# EAGLE design DiveComputer_STM32 (EAGLE 7.2.0)
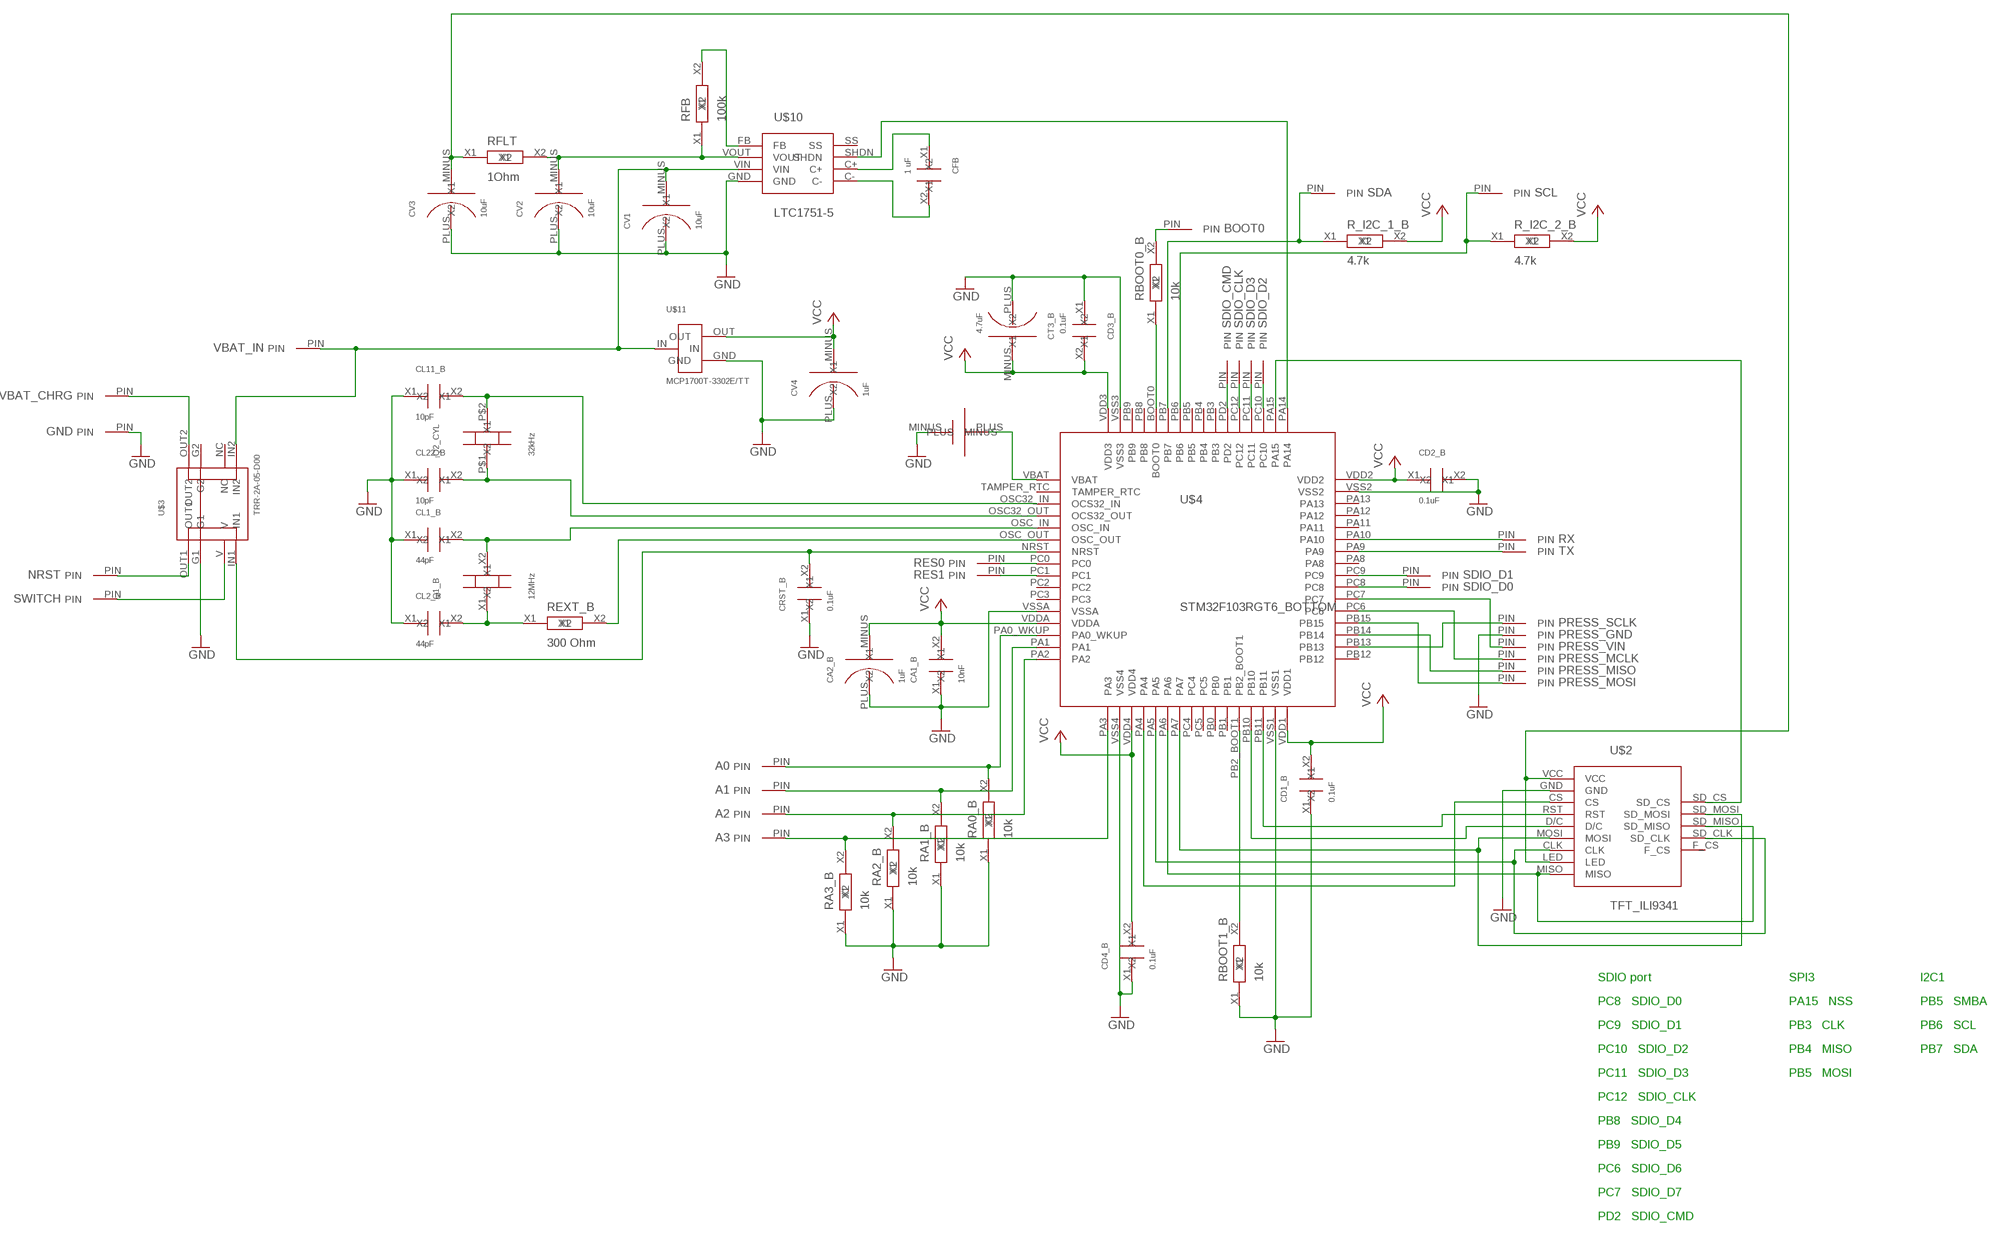
[diagram p0: schematic, sheet 1]

## Parts
A0  PIN  [PIN]
A1  PIN  [PIN]
A2  PIN  [PIN]
A3  PIN  [PIN]
BOOT0  PIN  [PIN]
CA1_B  10nF  C_SMD_2.1X1.25_BOTTOM  [SMD_2.1X1.25_BOTTOM]
CA2_B  1uF  C_SMD_TA_A_BOTTOM  [C_SMD_TA_A_BOTTOM]
CD1_B  0.1uF  C_SMD_2.1X1.25_BOTTOM  [SMD_2.1X1.25_BOTTOM]
CD2_B  0.1uF  C_SMD_2.1X1.25_BOTTOM  [SMD_2.1X1.25_BOTTOM]
CD3_B  0.1uF  C_SMD_2.1X1.25_BOTTOM  [SMD_2.1X1.25_BOTTOM]
CD4_B  0.1uF  C_SMD_2.1X1.25_BOTTOM  [SMD_2.1X1.25_BOTTOM]
CFB  1 uF  C_SMD_2.1X1.25  [SMD_2.1X1.25]
CL1_B  44pF  C_SMD_2.1X1.25_BOTTOM  [SMD_2.1X1.25_BOTTOM]
CL2_B  44pF  C_SMD_2.1X1.25_BOTTOM  [SMD_2.1X1.25_BOTTOM]
CL11_B  10pF  C_SMD_2.1X1.25_BOTTOM  [SMD_2.1X1.25_BOTTOM]
CL22_B  10pF  C_SMD_2.1X1.25_BOTTOM  [SMD_2.1X1.25_BOTTOM]
CRST_B  0.1uF  C_SMD_2.1X1.25_BOTTOM  [SMD_2.1X1.25_BOTTOM]
CT3_B  4.7uF  C_SMD_TA_A_BOTTOM  [C_SMD_TA_A_BOTTOM]
CV1  10uF  C_SMD_TA_A  [C_SMD_TA_A]
CV2  10uF  C_SMD_TA_A  [C_SMD_TA_A]
CV3  10uF  C_SMD_TA_A  [C_SMD_TA_A]
CV4  1uF  C_SMD_TA_A  [C_SMD_TA_A]
GND  PIN  [PIN]
NRST  PIN  [PIN]
PRESS_GND  PIN  [PIN]
PRESS_MCLK  PIN  [PIN]
PRESS_MISO  PIN  [PIN]
PRESS_MOSI  PIN  [PIN]
PRESS_SCLK  PIN  [PIN]
PRESS_VIN  PIN  [PIN]
Q1_B  12MHz  QUARTZ_SMD_BOTTOM  [QUARTZ_SMD_BOTTOM]
Q2_CYL  32kHz  QUARTZ_CYL  [QUARTZ_CYL]
R_I2C_1_B  4.7k  R_SMD_2.1X1.25_BOTTOM  [SMD_2.1X1.25_BOTTOM]
R_I2C_2_B  4.7k  R_SMD_2.1X1.25_BOTTOM  [SMD_2.1X1.25_BOTTOM]
RA0_B  10k  R_SMD_2.1X1.25_BOTTOM  [SMD_2.1X1.25_BOTTOM]
RA1_B  10k  R_SMD_2.1X1.25_BOTTOM  [SMD_2.1X1.25_BOTTOM]
RA2_B  10k  R_SMD_2.1X1.25_BOTTOM  [SMD_2.1X1.25_BOTTOM]
RA3_B  10k  R_SMD_2.1X1.25_BOTTOM  [SMD_2.1X1.25_BOTTOM]
RBOOT0_B  10k  R_SMD_2.1X1.25_BOTTOM  [SMD_2.1X1.25_BOTTOM]
RBOOT1_B  10k  R_SMD_2.1X1.25_BOTTOM  [SMD_2.1X1.25_BOTTOM]
RES0  PIN  [PIN]
RES1  PIN  [PIN]
REXT_B  300 Ohm  R_SMD_2.1X1.25_BOTTOM  [SMD_2.1X1.25_BOTTOM]
RFB  100k  R_SMD_2.1X1.25  [SMD_2.1X1.25]
RFLT  1Ohm  R_SMD_2.1X1.25  [SMD_2.1X1.25]
RX  PIN  [PIN]
SCL  PIN  [PIN]
SDA  PIN  [PIN]
SDIO_CLK  PIN  [PIN]
SDIO_CMD  PIN  [PIN]
SDIO_D0  PIN  [PIN]
SDIO_D1  PIN  [PIN]
SDIO_D2  PIN  [PIN]
SDIO_D3  PIN  [PIN]
SWITCH  PIN  [PIN]
TX  PIN  [PIN]
U$1  VBAT  [VBAT]
U$2  TFT_ILI9341  [TFT_ILI9341]
U$3  TRR-2A-05-D00  [TRR-2A-05-D00]
U$4  STM32F103RGT6_BOTTOM  [STM32F103RGT6_BOTTOM]
U$10  LTC1751-5  [LTC1751-5]
U$11  MCP1700T-3302E/TT  [MCP1700T-3302E/TT]
VBAT_CHRG  PIN  [PIN]
VBAT_IN  PIN  [PIN]

## Nets
GND: CA1_B.X1 CA2_B.PLUS(X1) CD1_B.X1 CD2_B.X2 CD3_B.X1 CD4_B.X1 CL1_B.X1 CL2_B.X1 CL11_B.X1 CL22_B.X1 CRST_B.X1 CT3_B.PLUS(X1) CV1.PLUS(X1) CV2.PLUS(X1) CV3.PLUS(X1) CV4.PLUS(X1) GND.PIN PRESS_GND.PIN RA0_B.X1 RA1_B.X1 RA2_B.X1 RA3_B.X1 RBOOT1_B.X1 U$1.MINUS U$2.GND U$3.G1 U$4.VSS1 U$4.VSS2 U$4.VSS3 U$4.VSS4 U$4.VSSA U$10.GND U$11.GND
N$1: CL11_B.X2 Q2_CYL.P$2(X2) U$4.OSC32_IN(OCS32_IN)
N$2: CL22_B.X2 Q2_CYL.P$1(X1) U$4.OSC32_OUT(OCS32_OUT)
N$3: CL2_B.X2 Q1_B.X1 REXT_B.X1
N$4: CL1_B.X2 Q1_B.X2 U$4.OSC_IN
N$5: REXT_B.X2 U$4.OSC_OUT
N$6: CRST_B.X2 U$3.IN1 U$4.NRST
N$7: U$2.CLK U$2.SD_CLK U$4.PA5
N$8: U$2.MOSI U$2.SD_MOSI U$4.PA7
N$9: U$2.MISO U$2.SD_MISO U$4.PA6
N$10: U$2.CS U$4.PA4
N$11: U$2.RST U$4.PB11
N$12: U$2.D/C U$4.PB10
N$13: A0.PIN RA0_B.X2 U$4.PA0_WKUP
N$14: A1.PIN RA1_B.X2 U$4.PA1
N$15: A2.PIN RA2_B.X2 U$4.PA2
N$16: A3.PIN RA3_B.X2 U$4.PA3
N$17: BOOT0.PIN RBOOT0_B.X2
N$18: RBOOT1_B.X2 U$4.PB2_BOOT1
N$19: RBOOT0_B.X1 U$4.BOOT0
N$20: PRESS_SCLK.PIN U$4.PB13
N$21: PRESS_MISO.PIN U$4.PB14
N$22: PRESS_MOSI.PIN U$4.PB15
N$23: PRESS_MCLK.PIN U$4.PC6
N$24: U$2.SD_CS U$4.PA15
N$25: U$4.PA14 U$10.SHDN
N$26: U$3.OUT2 VBAT_CHRG.PIN
N$27: NRST.PIN U$3.OUT1
N$28: CV2.MINUS(X2) RFB.X1 RFLT.X2 U$10.VOUT
N$29: RFB.X2 U$10.FB
N$30: CFB.X1 U$10.C+
N$31: CFB.X2 U$10.C-
N$32: CV3.MINUS(X2) RFLT.X1 U$2.LED U$2.VCC
N$33: CV1.MINUS(X2) U$3.IN2 U$10.VIN U$11.IN VBAT_IN.PIN
N$34: SWITCH.PIN U$3.V
N$35: TX.PIN U$4.PA9
N$36: RX.PIN U$4.PA10
N$37: PRESS_VIN.PIN U$4.PC7
N$38: R_I2C_1_B.X1 SDA.PIN U$4.PB7
N$39: R_I2C_2_B.X1 SCL.PIN U$4.PB6
N$40: U$1.PLUS U$4.VBAT
N$41: RES0.PIN U$4.PC0
N$42: RES1.PIN U$4.PC1
N$43: SDIO_D0.PIN U$4.PC8
N$44: SDIO_D1.PIN U$4.PC9
N$45: SDIO_CMD.PIN U$4.PD2
N$46: SDIO_CLK.PIN U$4.PC12
N$47: SDIO_D3.PIN U$4.PC11
N$48: SDIO_D2.PIN U$4.PC10
VCC: CA1_B.X2 CA2_B.MINUS(X2) CD1_B.X2 CD2_B.X1 CD3_B.X2 CD4_B.X2 CT3_B.MINUS(X2) CV4.MINUS(X2) R_I2C_1_B.X2 R_I2C_2_B.X2 U$4.VDD1 U$4.VDD2 U$4.VDD3 U$4.VDD4 U$4.VDDA U$11.OUT
Unconnected: U$2.F_CS U$3.G2 U$3.NC U$4.PA8 U$4.PA11 U$4.PA12 U$4.PA13 U$4.PB0 U$4.PB1 U$4.PB3 U$4.PB4 U$4.PB5 U$4.PB8 U$4.PB9 U$4.PB12 U$4.PC2 U$4.PC3 U$4.PC4 U$4.PC5 U$4.TAMPER_RTC U$10.SS

## Notes on the sheet
- SDIO port | SPI3 | I2C1
- PC8   SDIO_D0 | PA15   NSS | PB5   SMBA
- PC9   SDIO_D1 | PB3   CLK | PB6   SCL
- PC10   SDIO_D2 | PB4   MISO | PB7   SDA
- PC11   SDIO_D3 | PB5   MOSI
- PC12   SDIO_CLK
- PB8   SDIO_D4
- PB9   SDIO_D5
- PC6   SDIO_D6
- PC7   SDIO_D7
- PD2   SDIO_CMD

## Library data of the parts
A0 A1-A3 BOOT0 GND NRST PRESS_GND PRESS_MCLK PRESS_MISO PRESS_MOSI PRESS_SCLK PRESS_VIN RES0 RES1 RX SCL SDA SDIO_CLK SDIO_CMD SDIO_D0 SDIO_D1-SDIO_D3 SWITCH TX VBAT_CHRG VBAT_IN = MySTM32F103RGT6:PIN
CA1_B CD1_B CD2_B CD3_B CD4_B CL1_B CL2_B CL11_B CL22_B CRST_B = MyPowerComponents:C_SMD_2.1X1.25_BOTTOM
CA2_B CT3_B = MyAmSys:C_SMD_TA_A_BOTTOM
CFB = MyPowerComponents:C_SMD_2.1X1.25
CV1-CV4 = MyAmSys:C_SMD_TA_A
Q1_B = MySTM32F103RGT6:QUARTZ_SMD_BOTTOM
Q2_CYL = MySTM32F103RGT6:QUARTZ_CYL
R_I2C_1_B R_I2C_2_B RA0_B RA1_B RA2_B RA3_B RBOOT0_B RBOOT1_B REXT_B = MyPowerComponents:R_SMD_2.1X1.25_BOTTOM
RFB RFLT = MyPowerComponents:R_SMD_2.1X1.25
U$1 = My_STM32:VBAT
U$2 = MySTM32F103RGT6:TFT_ILI9341
U$3 = MySTM32F103RGT6:TRR-2A-05-D00
U$4 = MySTM32F103RGT6:STM32F103RGT6_BOTTOM
U$10 = MyPowerComponents:LTC1751-5
U$11 = MyDuino:MCP1700T-3302E/TT

## Board
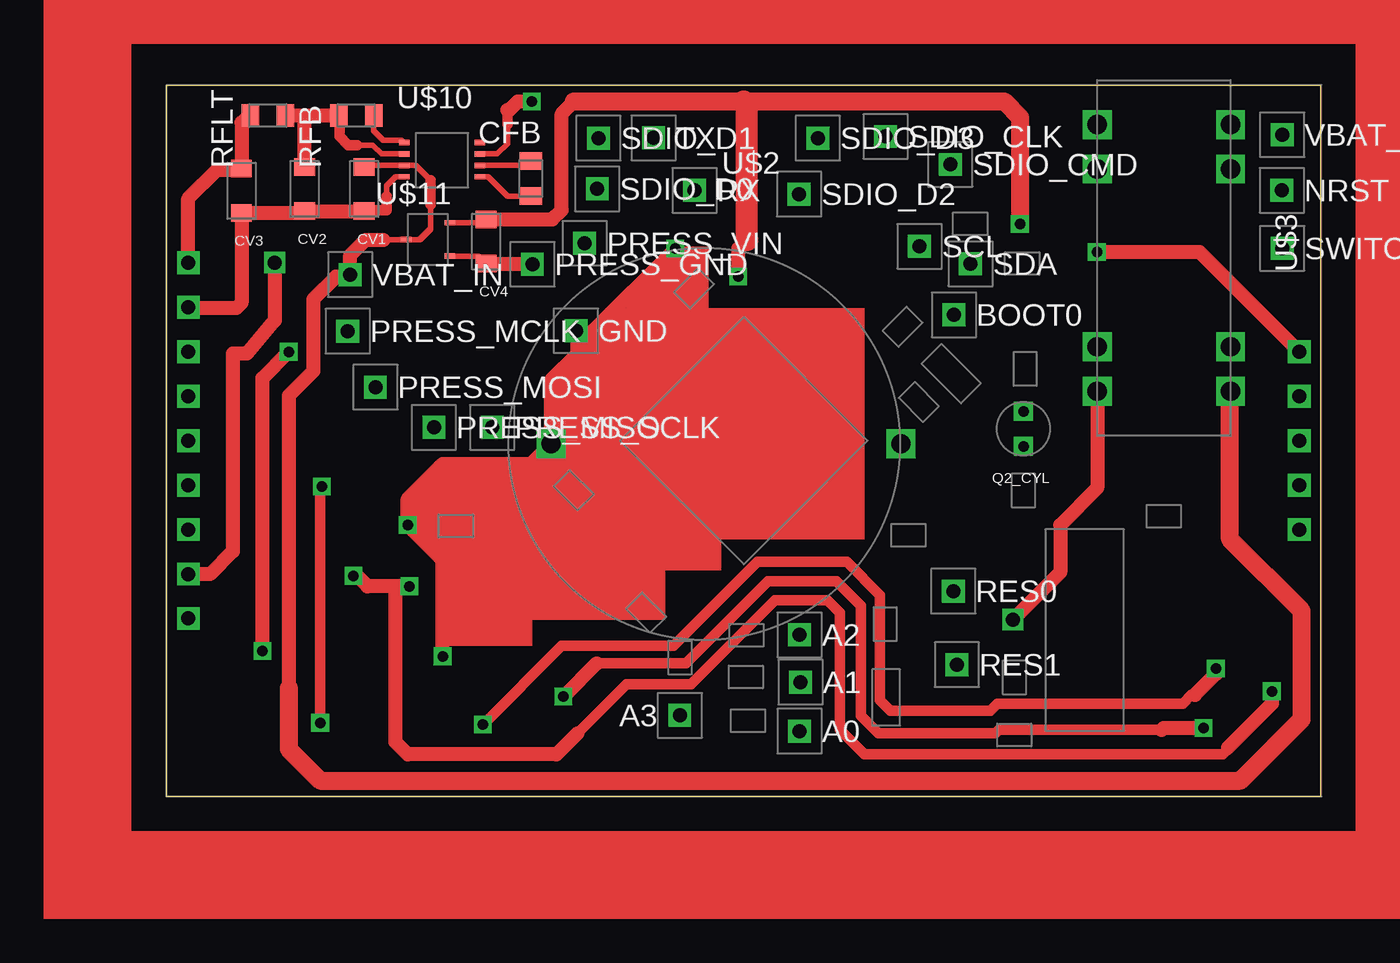
[diagram p1: board, top side]
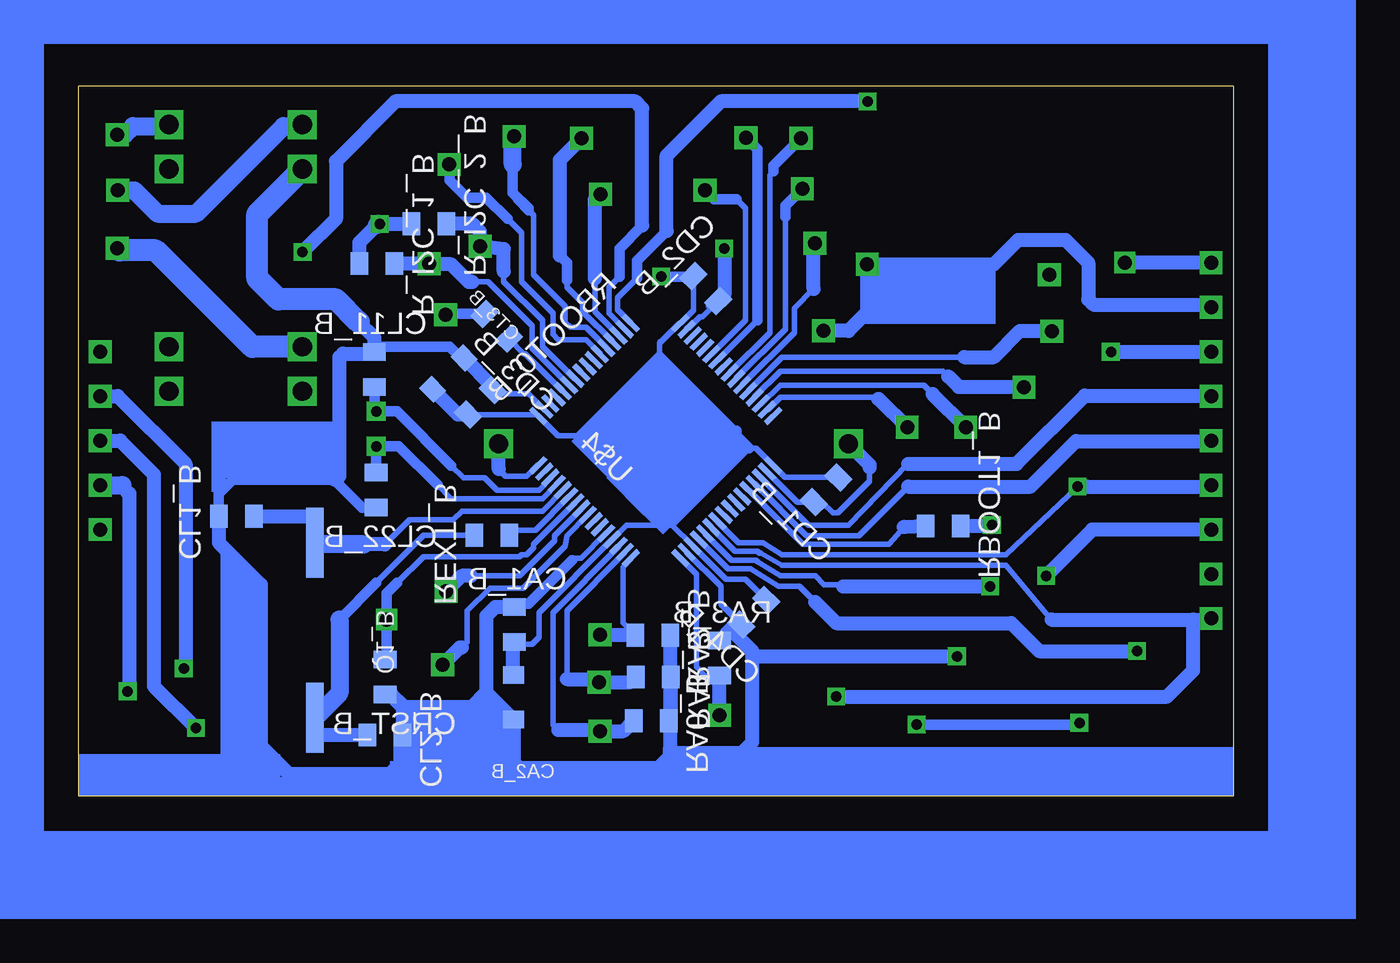
[diagram p2: board, bottom side, seen from below]

Size 66 x 40.6 mm. Coordinates in mm from the lower left corner, seen from the top.
Outline: 0,0 66,0 66,40.6 0,40.6 0,0
Copper layers (1*16): Top 0.035mm / dielectric 1.5mm / Bottom 0.035mm
Design rules "default": minimum track width 10mil, minimum drill 24mil, track to track 8mil, track to pad 8mil, pad to pad 8mil, via to via 8mil, smd to smd 8mil, copper to edge 40mil, drill to drill 8mil, minimum pad ring 10mil, minimum via ring 8mil, stop-mask expansion 4mil, vias tented up to drill 0mil, thermal gap 10mil

### Footprints (pad centres in the part's own frame; a part is rotated, then mirrored left to right if it is on the bottom)
PIN = drill 0.8 square: PIN 0,0
SMD_2.1X1.25_BOTTOM = smd 1.3 x 1 bottom: X1 0,1; X2 0,-1
C_SMD_TA_A_BOTTOM = smd 1.2 x 1 bottom: MINUS 0,-1.27; PLUS 0,1.27
SMD_2.1X1.25 = smd 1.3 x 1: X1 0,1; X2 0,-1
C_SMD_TA_A = smd 1.2 x 1: MINUS 0,-1.27; PLUS 0,1.27
QUARTZ_SMD_BOTTOM = smd 4 x 1 bottom: X1 -5,0; X2 5,0
QUARTZ_CYL = drill 0.6 square: P$1 0,1; P$2 0,-1
VBAT = drill 1.1 square: MINUS 10,0; PLUS -10,0
TFT_ILI9341 = drill 0.8 square: CLK -31.75,-5.08; CS -31.75,5.08; D/C -31.75,0; F_CS 31.75,-5.08; GND -31.75,7.62; LED -31.75,-7.62; MISO -31.75,-10.16; MOSI -31.75,-2.54; RST -31.75,2.54; SD_CLK 31.75,-2.54; SD_CS 31.75,5.08; SD_MISO 31.75,0; SD_MOSI 31.75,2.54; VCC -31.75,10.16
TRR-2A-05-D00 = drill 1.1 square: G1 -5.08,-2.54; G2 -5.08,5.08; IN1 7.62,-2.54; IN2 7.62,5.08; NC 5.08,5.08; OUT1 -7.62,-2.54; OUT2 -7.62,5.08; V 5.08,-2.54
STM32F103RGT6_BOTTOM = smd 1.2 x 0.3 bottom: BOOT0 -5.75,1.75; PA3 5.75,3.75; PA4 5.75,2.25; PA5 5.75,1.75; PA6 5.75,1.25; PA7 5.75,0.75; PA14 -5.75,-3.75; PA15 -5.75,-3.25; PB0 5.75,-0.75; PB1 5.75,-1.25; PB2_BOOT1 5.75,-1.75; PB3 -5.75,-0.75; PB4 -5.75,-0.25; PB5 -5.75,0.25; PB6 -5.75,0.75; PB7 -5.75,1.25; PB8 -5.75,2.25; PB9 -5.75,2.75; PB10 5.75,-2.25; PB11 5.75,-2.75; PC4 5.75,0.25; PC5 5.75,-0.25; PC10 -5.75,-2.75; PC11 -5.75,-2.25; PC12 -5.75,-1.75; PD2 -5.75,-1.25; VDD1 5.75,-3.75; VDD3 -5.75,3.75; VDD4 5.75,2.75; VSS1 5.75,-3.25; VSS3 -5.75,3.25; VSS4 5.75,3.25 | smd 0.3 x 1.2 bottom: NRST -0.75,5.75; OSC32_IN -2.75,5.75; OSC32_OUT -2.25,5.75; OSC_IN -1.75,5.75; OSC_OUT -1.25,5.75; PA0_WKUP 2.75,5.75; PA1 3.25,5.75; PA2 3.75,5.75; PA8 -0.25,-5.75; PA9 -0.75,-5.75; PA10 -1.25,-5.75; PA11 -1.75,-5.75; PA12 -2.25,-5.75; PA13 -2.75,-5.75; PB12 3.75,-5.75; PB13 3.25,-5.75; PB14 2.75,-5.75; PB15 2.25,-5.75; PC0 -0.25,5.75; PC1 0.25,5.75; PC2 0.75,5.75; PC3 1.25,5.75; PC6 1.75,-5.75; PC7 1.25,-5.75; PC8 0.75,-5.75; PC9 0.25,-5.75; TAMPER_RTC -3.25,5.75; VBAT -3.75,5.75; VDD2 -3.75,-5.75; VDDA 2.25,5.75; VSS2 -3.25,-5.75; VSSA 1.75,5.75
LTC1751-5 = smd 0.61 x 0.305: C+ 2.15,0; C- 2.15,-0.65; FB -2.15,1.3; GND -2.15,-0.65; SHDN 2.15,0.65; SS 2.15,1.3; VIN -2.15,0; VOUT -2.15,0.65
MCP1700T-3302E/TT = smd 0.61 x 0.305: GND 1.25,-0.95; IN -1.25,0; OUT 1.25,0.95

### Placement (x,y rotation side)
A0  36.21,3.72 0 top
A1  36.26,6.52 0 top
A2  36.21,9.22 0 top
A3  29.36,4.62 180 top
BOOT0  45.03,27.51 0 top
CA1_B  41.1,9.81 0 top
CA2_B  41.15,5.65 180 top
CD1_B  23.28,17.51 225 top
CD2_B  30.16,29.01 315 top
CD3_B  43.04,22.51 45 top
CD4_B  27.42,10.51 225 top
CFB  20.84,35.3 0 top
CL1_B  57,16 270 top
CL2_B  48.5,3.5 90 top
CL11_B  49.1,24.4 0 top
CL22_B  49,17.5 180 top
CRST_B  48.49,6.81 180 top
CT3_B  44.87,24.15 45.1 top
CV1  11.32,34.7 180 top
CV2  7.91,34.7 180 top
CV3  4.3,34.6 180 top
CV4  18.29,31.7 180 top
GND  23.42,26.6 0 top
NRST  63.78,34.62 0 top
PRESS_GND  20.93,30.4 0 top
PRESS_MCLK  10.38,26.58 0 top
PRESS_MISO  15.3,21.08 0 top
PRESS_MOSI  11.96,23.38 0 top
PRESS_SCLK  18.64,21.08 0 top
PRESS_VIN  23.92,31.6 0 top
Q1_B  52.5,9.5 90 top
Q2_CYL  49,21 180 top
R_I2C_1_B  48.95,30.45 90 top
R_I2C_2_B  45.98,32.71 90 top
RA0_B  33.28,4.31 90 top
RA1_B  33.16,6.81 90 top
RA2_B  33.19,9.2 90 top
RA3_B  29.37,7.9 0 top
RBOOT0_B  42.11,26.85 135.1 top
RBOOT1_B  16.58,15.45 90 top
RES0  44.99,11.72 0 top
RES1  45.2,7.52 0 top
REXT_B  42.4,14.91 270 top
RFB  10.86,38.9 90 top
RFLT  5.82,38.9 90 top
RX  30.21,34.62 0 top
SCL  43.06,31.42 0 top
SDA  45.98,30.42 0 top
SDIO_CLK  41.12,37.7 0 top
SDIO_CMD  44.82,36.1 0 top
SDIO_D0  24.64,34.71 0 top
SDIO_D1  24.71,37.61 0 top
SDIO_D2  36.18,34.41 0 top
SDIO_D3  37.25,37.61 0 top
SWITCH  63.79,31.31 0 top
TX  27.86,37.62 0 top
U$1  32,20.14 180 top
U$2  33.02,20.32 0 top
U$3  55.76,30.76 270 top
U$4  33.02,20.32 225 top
U$10  15.77,36.05 0 top
U$11  14.96,31.82 0 top
VBAT_CHRG  63.79,37.8 0 top
VBAT_IN  10.52,29.81 0 top

### Tracks (layer width: path | path; a pad name or v marks a point on that pad's centre or on a via)
GND  (via drill 0.6)
  Top 0.254: U$11.GND 17.83,30.87 17.9,30.8 18.3,30.8 18.6,30.5 20.8,30.5 v20.9,30.4
  Top 0.305: U$10.GND 13.1,35.4 12.6,34.9 12.6,34.3 | U$11.GND 17.85,30.87 CV4.PLUS
  Top 0.61: 12.6,34.3 12.6,33.5 11.39,33.5 CV1.PLUS
  Top 0.813: CV1.PLUS CV2.PLUS 7.81,33.33 CV3.PLUS 4.3,28.2 4,27.9 1.31,27.9 U$2.GND | v15.8,8 15.8,13.5 v13.8,15.5 13.8,17 15.8,19 20.86,19 U$1.MINUS 22,23.8 23.5,25.3 23.5,26.52 | 23.5,26.52 GND.PIN | PRESS_GND.PIN v20.9,30.4 18.32,30.4 CV4.PLUS | 23.5,26.52 24.32,26.52 v29.1,31.3
  Bottom 0.254: 29.3,12 29.3,10.9 29.1,10.9 28,9.8 28,9.1 28.2,8.9 28.2,8.7 27.5,8
  Bottom 0.305: U$4.VSS2 31.25,26.75 31.15,26.75 30.5,27.4 30.36,27.4 CD2_B.X2 29.76,28 30,28 | U$4.VSS1 24.91,16.8 CD1_B.X1 23.5,16.8 22.9,16.2 22.6,16.2 20.8,18 20.8,18.8 | U$4.VSS4 29.3,12 29.3,10.98 CD4_B.X1 | U$4.VSS3 40.3,23 42.12,23 CD3_B.X1 | U$4.VSSA 35.88,15.02 37.3,13.6 37.7,13.6 37.8,13.5
  Bottom 0.61: 37.8,13.5 40.3,11 40.91,11 CA1_B.X1 | CL22_B.X1 49.8,16.5 51.4,18.1 57.2,18.1 58,17.3 CL1_B.X1 | CT3_B.PLUS 44.15,25.05 44.8,25.7 48.8,25.7 CL11_B.X1
  Bottom 0.813: CD4_B.X1 28.47,9.8 28.73,9.54 | 28.73,9.54 RA3_B.X1 | RA0_B.X1 32.16,4.43 RA1_B.X1 32.19,6.84 RA2_B.X1 32.19,4.11 32.2,4.1 32.2,2.7 32,2.5 | 32,2.5 28.1,2.5 27.5,3.1 27.5,8 | 27.5,8 27.5,8.3 28.73,9.54 | CA1_B.X1 42.19,10.81 42.7,10.3 42.7,5.93 | 42.7,5.93 CA2_B.PLUS 41.15,1.95 40.8,1.6 32.9,1.6 32,2.5 | 47.5,5.1 47.5,5.2 48.11,5.81 CRST_B.X1 48.21,5.81 47.5,5.1 | 47.5,5.1 CL2_B.X1 47.6,3.4 47.6,1.9 48.2,1.3 54,1.3 55.6,2.9 55.6,12.1 58,14.5 CL1_B.X1 | 47.5,5.1 43.53,5.1 42.7,5.93 | CD3_B.X1 42.33,23.41 CT3_B.PLUS | 20.8,18.8 20.8,18.94 U$1.MINUS | RBOOT1_B.X1 13.85,15.45 v13.8,15.5 | 27.5,8 v15.8,8 | PRESS_GND.PIN 20.93,27.67 22,26.6 GND.PIN | v20.9,30.4 13.7,30.4 12.3,31.8 9.6,31.8 8.3,30.5 8.3,28.4 8,28.1 1.43,28.1 U$2.GND | 51.4,18.1 51.3,18.1 51.1,18.3 51.1,25.1 50.9,25.3 49.2,25.3 CL11_B.X1 49.1,26.2 50,27.1 | v29.1,31.3 29.1,28.66 CD2_B.X2
  Bottom 1.27: 50,27.1 51.3,28.4 54.6,28.4 55.8,29.6 55.8,33.26 U$3.G1
N$1
  Bottom 0.305: U$4.OSC32_IN 39.03,18.17 39.7,17.5 42.1,17.5 42.8,18.2 44,18.2 44.7,18.9
  Bottom 0.61: 44.7,18.9 47.8,22 Q2_CYL.P$2 49.1,22.1 CL11_B.X2
N$2
  Bottom 0.305: U$4.OSC32_OUT 38.68,17.82 39.5,17 44.7,17 45.5,17.8
  Bottom 0.61: 45.5,17.8 47.7,20 Q2_CYL.P$1 CL22_B.X2
N$3
  Bottom 0.305: REXT_B.X1 46.29,14.91 49,12.2
  Bottom 0.61: 49,12.2 51.1,10.1
  Bottom 0.813: CL2_B.X2 52.4,3.5 52.5,3.4 Q1_B.X1
  Bottom 1.016: 51.1,10.1 51.1,5.9 Q1_B.X1
N$4
  Bottom 0.305: U$4.OSC_IN 38.32,17.48 39.5,16.3 44.1,16.3 44.6,15.8 47.1,15.8 48.5,14.4
  Bottom 0.813: CL1_B.X2 52.6,16 52.5,15.9 Q1_B.X2 | 48.5,14.4 49.7,14.4
  Bottom 1.016: 49.7,14.4 52.4,14.4 Q1_B.X2
N$5
  Bottom 0.305: U$4.OSC_OUT 39.9,15.2 41.11,15.2 REXT_B.X2
N$6  (via drill 0.8)
  Top 0.813: U$3.IN1 53.22,17.62 51.1,15.5 51.1,12.8 v48.4,10.1
  Bottom 0.305: U$4.NRST | U$4.NRST 40,14.4 40,14.2 40.4,13.8 40.7,13.8 40.8,13.7 46.3,13.7 47.8,12.2
  Bottom 0.61: 47.8,12.2 48.4,11.6 48.4,10.2 | v48.4,10.1 48.4,7.9 CRST_B.X2
  Bottom 0.813: v48.4,10.1 48.4,10.2
N$7  (via drill 0.6)
  Top 0.61: 60.7,2.8 60.7,2.7 60.4,2.4 39.9,2.4 38.5,3.8 38.5,10.5 37.8,11.2 34.8,11.2 30,6.4 26.3,6.4 23.5,3.6
  Top 0.813: v13.9,12 13.1,12 | 13.1,12 11.5,12 10.9,12.6 v10.7,12.6 | v63.2,6 63.2,5.3 60.7,2.8 | 23.5,3.6 22.3,2.4 13.8,2.4 13.1,3.1 13.1,12
  Bottom 0.305: U$4.PA5 30.19,14.99 28.7,13.5 27.3,13.5 27.2,13.4 25.9,12.6 23.9,12.6 23.4,12.1 22.4,12.1 22.3,12
  Bottom 0.813: 22.3,12 v13.9,12 | U$2.CLK 8.06,15.24 v10.7,12.6 | 63.5,17.8 63.5,17.7 63.1,17.3 63.1,6.1 v63.2,6
  Bottom 1.016: U$2.SD_CLK 63.52,17.78 63.5,17.8
N$8  (via drill 0.6)
  Top 0.61: 58.8,5.8 58.6,5.8 58.1,5.3 47.5,5.3 47.1,4.9 41.4,4.9 40.8,5.5 40.8,11.5 38.9,13.4 33.8,13.4 29,8.6 22.6,8.6 v18.1,4.1 | v8.8,4.2 8.8,17.6 v8.9,17.7
  Top 0.813: v60,7.3 60,7 58.8,5.8
  Bottom 0.305: U$4.PA7 29.48,15.68 28.3,14.5 26.9,14.5 25.8,13.8 13,13.8 v8.9,17.7
  Bottom 0.61: v18.1,4.1 8.9,4.1 v8.8,4.2
  Bottom 0.813: v8.9,17.7 8.4,17.7 1.35,17.7 U$2.MOSI | U$2.SD_MOSI 63.76,22.86 59.9,19 59.9,7.4 v60,7.3
N$9  (via drill 0.6)
  Top 0.61: 56.9,3.8 47.6,3.8 47.4,3.6 40.7,3.6 39.7,4.6 39.7,10.9 38.3,12.3 34.4,12.3 29.7,7.6 24.6,7.6
  Top 0.813: v59.3,3.9 57,3.9 56.9,3.8 | 24.6,7.6 v22.7,5.7
  Bottom 0.305: U$4.PA6 29.84,15.34 28.5,14 27.2,14 27.1,13.9 27,13.9 25.8,13.2 13,13.2 10.4,10.1
  Bottom 0.813: 10.4,10.1 2.3,10.1 | 2.3,10.1 1.33,10.1 U$2.MISO | U$2.SD_MISO 63.62,20.32 61.7,18.4 61.7,6.3 v59.3,3.9 | v22.7,5.7 3.8,5.7 2.3,7.2 2.3,10.1
N$10  (via drill 0.6)
  Top 0.813: v5.5,8.3 5.5,23.9 v7,25.4
  Bottom 0.305: U$4.PA4 28.9,13 27.6,13 26,12 24.8,12 23.9,11.1
  Bottom 0.813: 23.9,11.1 22.7,9.9 12.7,9.9 11.1,8.3 v5.5,8.3 | v7,25.4 U$2.CS
N$11
  Bottom 0.305: U$4.PB11 27,18.2 24.3,15.5 22,15.5 18.6,19
  Bottom 0.813: 18.6,19 12.4,19 8.5,22.9 1.31,22.9 U$2.RST
N$12
  Bottom 0.305: U$4.PB10 27.34,17.84 24.4,14.9 21.4,14.9 18.6,17.7
  Bottom 0.813: 18.6,17.7 11.6,17.7 9,20.3 1.29,20.3 U$2.D/C
N$13
  Bottom 0.305: U$4.PA0_WKUP 35.14,14.26 38.9,10.5 38.9,4.1 38.6,3.8
  Bottom 0.813: 38.6,3.8 36.29,3.8 A0.PIN 34.87,3.72 RA0_B.X2
N$14
  Bottom 0.305: U$4.PA1 34.79,13.91 38.1,10.6 38.1,6.7
  Bottom 0.813: 38.1,6.7 36.44,6.7 A1.PIN 34.45,6.52 RA1_B.X2
N$15
  Bottom 0.305: U$4.PA2 34.43,13.57 34.9,13.1 34.9,9.91 RA2_B.X2
  Bottom 0.813: A2.PIN 34.19,9.22 RA2_B.X2
N$16
  Bottom 0.305: RA3_B.X2 30.2,6.9 30.7,7.4 30.7,12.7 U$4.PA3
  Bottom 0.813: A3.PIN RA3_B.X2
N$17
  Bottom 0.61: RBOOT0_B.X2 44.98,27.56 BOOT0.PIN
N$18
  Bottom 0.305: U$4.PB2_BOOT1 27.69,17.49 24.6,14.4 19.7,14.4 18.8,15.4
  Bottom 0.813: 18.8,15.4 18.83,15.4 RBOOT1_B.X2
N$19
  Bottom 0.305: U$4.BOOT0 38.35,23.15 40.5,25.3 40.56,25.3 RBOOT0_B.X1
N$20
  Bottom 0.305: U$4.PB13 26.61,22.09 25.9,22.8 20.4,22.8 20.3,22.7
  Bottom 0.813: 20.3,22.7 20.26,22.7 PRESS_SCLK.PIN
N$21
  Bottom 0.305: U$4.PB14 26.96,22.44 25.9,23.5 17.7,23.5 17.2,23
  Bottom 0.813: 17.2,23 17.2,22.98 PRESS_MISO.PIN
N$22
  Bottom 0.305: U$4.PB15 27.36,22.84 25.9,24.3 16.6,24.3 16.3,24
  Bottom 0.813: 16.3,24 15.7,23.4 11.98,23.4 PRESS_MOSI.PIN
N$23
  Bottom 0.305: U$4.PC6 27.72,23.18 25.8,25.1 15.4,25.1
  Bottom 0.813: 15.4,25.1 13.7,25.1 12.2,26.6 10.4,26.6 PRESS_MCLK.PIN
N$24  (via drill 0.6)
  Top 0.813: v53.2,31.1 59.07,31.1 U$2.SD_CS
  Bottom 0.305: U$4.PA15 35.7,27.6 35.7,29.1 35.1,29.7
  Bottom 0.61: 35.1,29.7 35.1,31.3 33.8,32.6
  Bottom 0.813: 33.8,32.6 33.8,39.3 34.2,39.7 47.9,39.7 51.3,36.3 51.3,33 v53.2,31.1
N$25  (via drill 0.6)
  Top 0.305: U$10.SHDN 18.9,36.7 19.5,37.3 19.5,38.4
  Top 0.61: 19.5,38.4 19.5,39.2
  Top 0.813: 19.5,39.2 19.6,39.2 20.1,39.7 v20.9,39.7
  Bottom 0.305: U$4.PA14 35.2,27.8 35.2,28.5 34.1,29.6
  Bottom 0.61: 34.1,29.6 34.1,30.6 32.4,32.3
  Bottom 0.813: 32.4,32.3 32.4,36.6 29.3,39.7 v20.9,39.7
N$26
  Bottom 1.016: VBAT_CHRG.PIN 63.4,37.8 62.9,38.3 60.92,38.3 U$3.OUT2
N$27
  Bottom 1.016: NRST.PIN 62.82,34.62 61.5,33.3 59.3,33.3 54.3,38.3 53.3,38.3 U$3.OUT1
N$28
  Top 0.305: U$10.VOUT 12.3,36.7 11.8,37.2 10.9,37.2
  Top 0.61: 10.9,37.2 10.4,37.2 9.9,37.7 9.9,38.86 RFB.X1
  Top 0.813: RFB.X1 7.8,38.9 | 7.8,38.9 RFLT.X2 | CV2.MINUS 7.91,38.79 7.8,38.9
N$29
  Top 0.305: RFB.X2 11.86,38.04 12.4,37.5 13.47,37.5 U$10.FB
N$30
  Top 0.305: U$10.C+ 20.59,36.05 CFB.X1
N$31
  Top 0.305: U$10.C- 18.4,35.4 19.5,34.3 CFB.X2
N$32  (via drill 0.8)
  Top 0.813: RFLT.X1 4.7,38.9 4.3,38.5 CV3.MINUS 4.23,35.8 2.9,35.8 1.27,34.17 U$2.VCC | v6.2,30.5 6.2,27.2 4.6,25.3 3.8,25.3 3.8,14 2.5,12.7 U$2.LED
  Bottom 0.813: U$2.VCC 5.98,30.48 v6.2,30.5
N$33
  Top 0.254: 15.1,32.4 15,32.4 14.4,31.8 11.9,31.8 11.8,31.7 11.3,31.7 10.5,30.9 10.5,29.7
  Top 0.305: CV1.MINUS 11.4,36.05 U$10.VIN 14.25,36.05 15.1,35.2 | 15.1,33.8 15.1,32.4 14.5,31.8 14.4,31.8 13.73,31.8 U$11.IN 13.69,31.8 12.4,31.8
  Top 0.61: 15.1,35.2 15.1,33.8
  Top 0.813: VBAT_IN.PIN 10.52,30.92 11.4,31.8 12.4,31.8 | 10.5,29.7 9.7,29.7 8.4,28.4 8.4,24.3 7,22.9 7,6.2
  Top 1.016: 7,6.2 7,2.7 8.8,0.9 61.4,0.9 64.9,4.4 64.9,10.6 60.8,14.7 60.8,23.1 U$3.IN2
N$34
  Bottom 1.27: U$3.V 56.08,25.68 61.6,31.2 63.68,31.2 SWITCH.PIN
N$35
  Bottom 0.305: U$4.PA9 | U$4.PA9 27.2,27.2
  Bottom 0.61: 27.2,27.2 27.2,36.96 TX.PIN
N$36
  Bottom 0.305: U$4.PA10 27.9,27.2 27.9,33.6 28.4,34.1
  Bottom 0.61: 28.4,34.1 29.69,34.1 RX.PIN
N$37
  Bottom 0.305: U$4.PC7 28.07,23.53 25.1,26.5 25.1,27.9 24,29
  Bottom 0.813: 24,29 24,31.52 PRESS_VIN.PIN
N$38
  Bottom 0.305: U$4.PB7 38,23.5 40.1,25.6 40.1,26.9 42.6,29.4 43.5,29.4
  Bottom 0.813: 43.5,29.4 43.7,29.4 44.7,30.4 45.96,30.4 SDA.PIN 47.92,30.42 R_I2C_1_B.X1
N$39
  Bottom 0.305: U$4.PB6 37.66,23.86 39.5,25.7 39.5,27.2 41.7,29.4 41.7,30
  Bottom 0.813: 41.7,30 41.7,31.26 SCL.PIN 43.06,32.26 43.5,32.7 R_I2C_2_B.X1
N$40
  Bottom 0.305: U$4.VBAT 39.79,18.91 40.4,18.3 41.6,18.3 42,18.7
  Bottom 0.813: 42,18.7 U$1.PLUS
N$41
  Bottom 0.305: U$4.PC0 38.8,14.9 38.8,14.6 40.8,12.6 43.6,12.6
  Bottom 0.813: 43.6,12.6 44.11,12.6 RES0.PIN
N$42
  Bottom 0.305: U$4.PC1 36.92,16.08 38.1,14.9 38.2,14.3 40.6,11.9 42.5,11.9 43.8,10.6 43.8,8.8 44.1,8.5
  Bottom 0.813: 44.1,8.5 44.22,8.5 RES1.PIN
N$43
  Bottom 0.305: U$4.PC8 28.42,23.88 25.6,26.7 25.6,33.1
  Bottom 0.61: 25.6,33.1 25.6,33.75 SDIO_D0.PIN
N$44
  Bottom 0.305: U$4.PC9 28.78,24.22 26.5,26.5 26.5,35.5 26.3,35.7
  Bottom 0.61: 26.3,35.7 26.3,36.02 SDIO_D1.PIN
N$45
  Bottom 0.305: U$4.PD2 36.2,25.3 37,26.1 38.6,26.1 38.9,26.4 38.9,27.6 40.7,29.4 40.7,32.2 41.5,33
  Bottom 0.61: 41.5,33 42.7,34.2 43.8,34.2 44.8,35.2 44.8,36.08 SDIO_CMD.PIN
N$46
  Bottom 0.305: U$4.PC12 35.85,25.65 37,26.8 37.9,26.8 38.2,27.1 38.2,28 40,29.8 40,33.2 40.3,33.5
  Bottom 0.61: 40.9,34.1 40.3,33.5 40.3,33.6 41.2,34.5 41.2,36.1
  Bottom 1.016: 41.2,36.1 41.2,37.62 SDIO_CLK.PIN
N$47
  Bottom 0.305: U$4.PC11 35.49,26 37.2,27.7 37.2,28.2 38.1,29.1 38.1,29.5
  Bottom 0.61: 38.1,29.5 38.1,30.5 38.5,30.9
  Bottom 0.813: 38.5,30.9 38.5,36.36 SDIO_D3.PIN
N$48
  Bottom 0.305: U$4.PC10 35.14,26.34 36.5,27.7 36.5,29.6
  Bottom 0.813: 36.5,29.6 36.5,34.09 SDIO_D2.PIN
VCC  (via drill 0.6)
  Top 0.305: U$11.OUT 18.09,32.77 CV4.MINUS
  Top 0.813: CV4.MINUS 22.07,32.97 22.6,33.5 22.6,39 23.3,39.7 | v32.7,29.7 32.7,31.3 33.2,31.8
  Top 1.016: 23.3,39.7 33,39.7 47.9,39.7 48.8,38.8 v48.8,32.7
  Top 1.27: 33.2,31.8 33.2,39.5 33,39.7
  Bottom 0.254: CT3_B.MINUS 45.75,23.25 44.3,21.8 39.8,21.8 38.7,20.7 38.7,20.6 37.5,20.6 | 32.8,25.3 32.8,26 32.7,26 30.9,27.8 30.9,29.7
  Bottom 0.305: CD3_B.X2 39.81,21.8 U$4.VDD3 38.7,20.7 38.6,20.6 37.5,20.6 32.8,25.3 | CD1_B.X2 25.61,18.22 | 25.61,18.22 U$4.VDD1 | CD4_B.X2 27.9,12.4 29,12.4 30.9,14.3 U$4.VDD4 32.09,15.5 | CD2_B.X1 30.87,27.78 U$4.VDD2 31.66,27.04 32.8,25.9 32.8,25.3 | CA1_B.X2 40.99,8.7 40.1,8.7 39.7,9.1 39.7,10.5 35.54,14.66 U$4.VDDA 35.49,14.71 34.7,15.5 32.09,15.5 | 25.61,18.22 25.62,18.22 27.3,19.9 27.7,19.9 27.7,19.89 32.09,15.5 | 32.8,25.3 28.4,20.9
  Bottom 0.61: 28.4,20.9 28.4,20.59 27.7,19.89 | 30.9,29.7 v32.7,29.7
  Bottom 0.813: 40.99,8.7 41.2,8.7 41.2,6.97 CA2_B.MINUS | CD3_B.X2 44.32,21.8 CT3_B.MINUS | R_I2C_1_B.X2 49.95,31.65 48.95,32.65 | v48.8,32.7 R_I2C_2_B.X2
  Bottom 1.016: v48.8,32.7 48.9,32.7 48.95,32.65
(copper drawn outside any net)
  shapes: Bottom area x29, Top area x21